# Altium schematic sheet Audio.SchDoc
size B; SheetNumber: 2; SheetTotal: 5
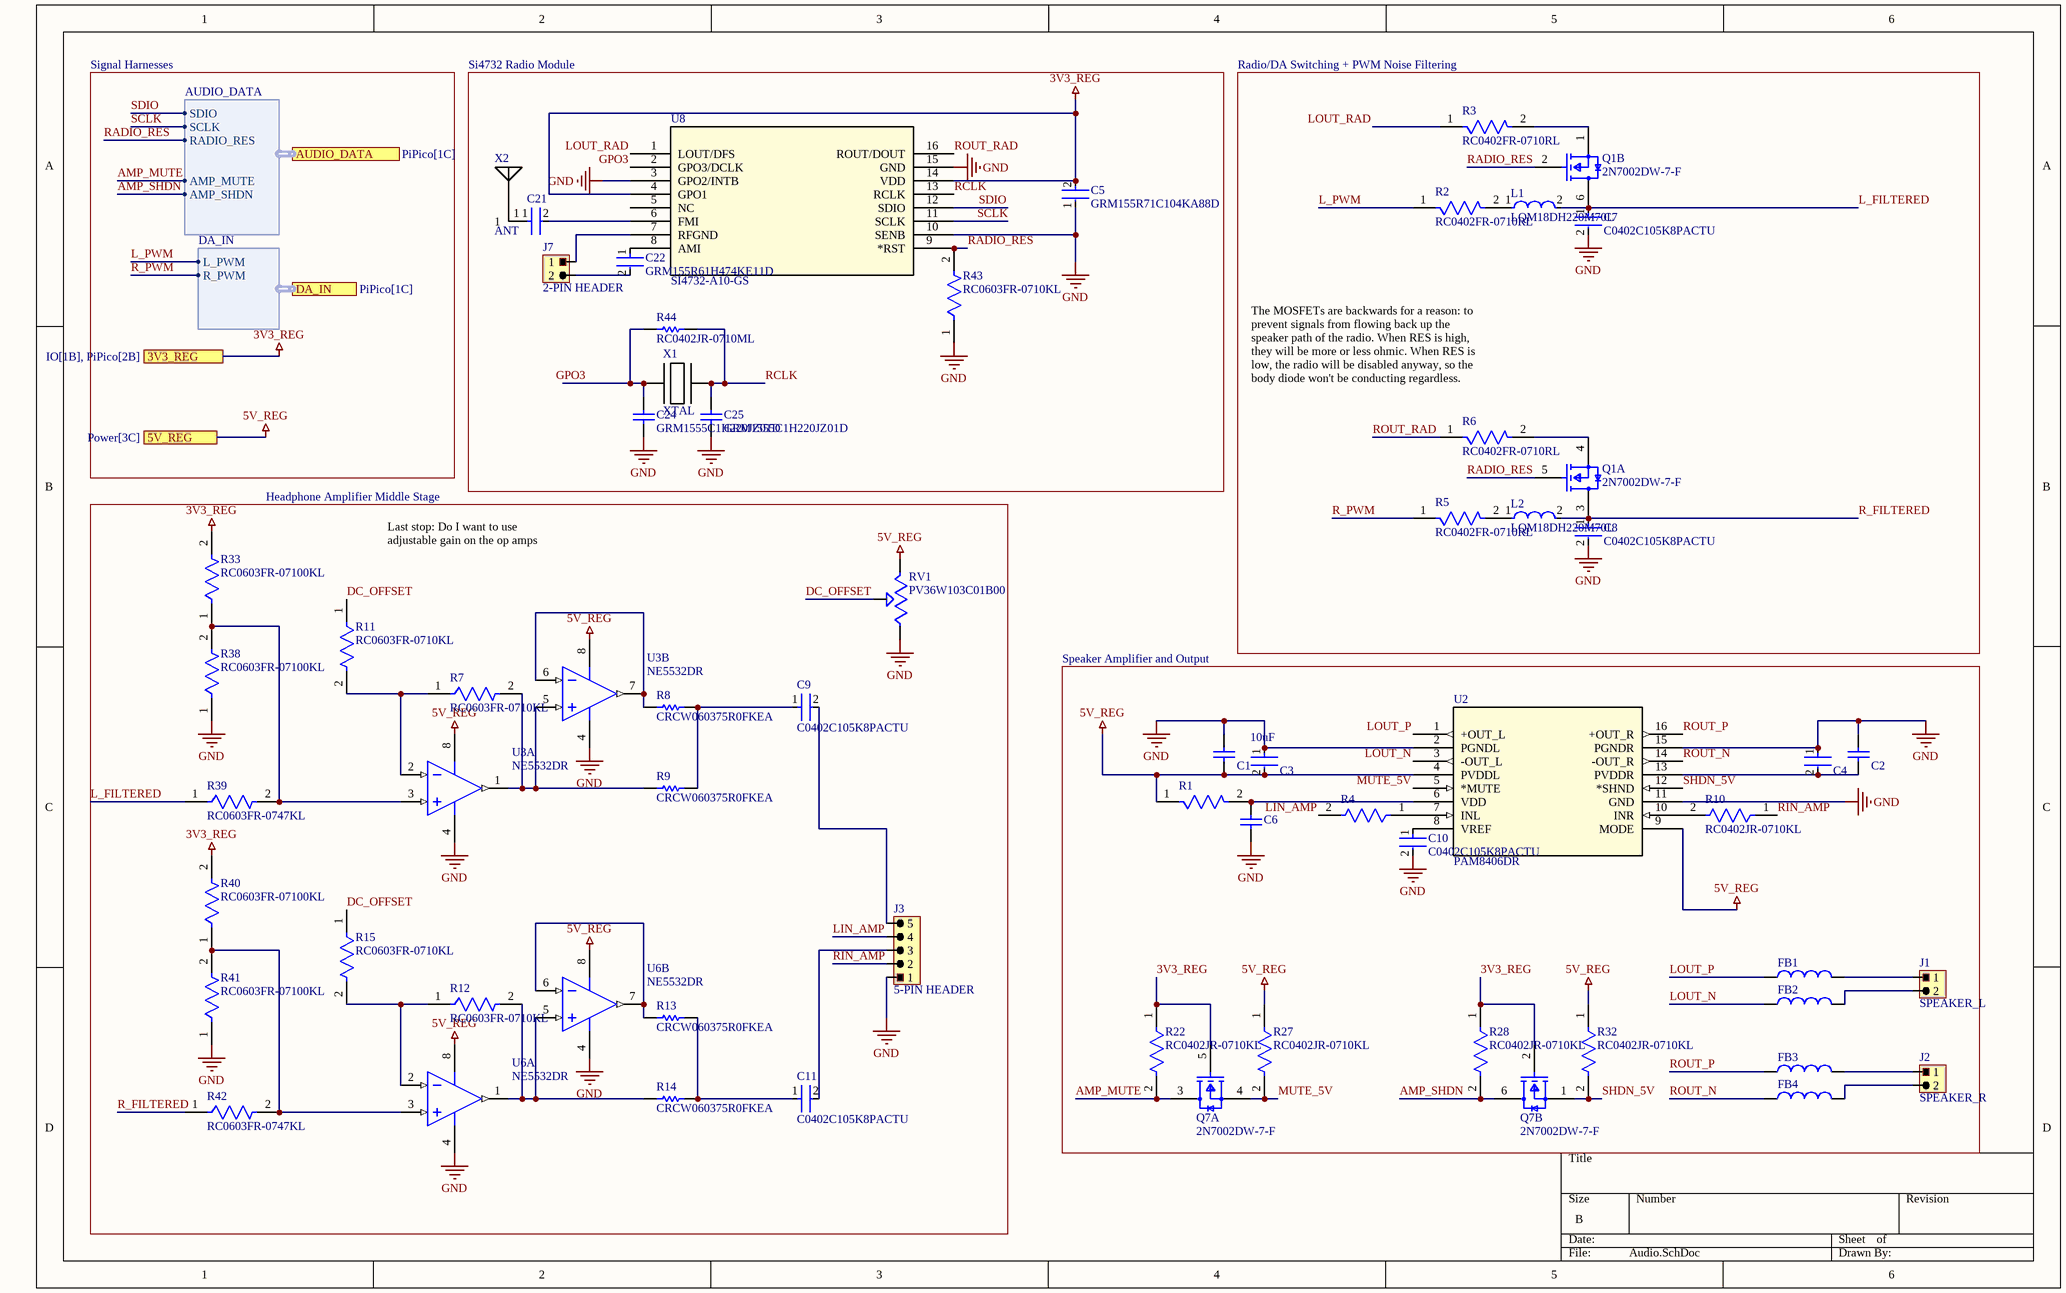
[diagram p0: Audio.SchDoc]

## Parts
C1  C0603C105K3RACTU  [CAPC1608X87X35LL15T15]  (value not drawn)
C2  C0603C105K3RACTU  [CAPC1608X87X35LL15T15]  (value not drawn)
C3  Capacitance: 10uF  [FP-C0805C-DG-MFG]  (hidden comment: C0805C106K8PACTU)
C4  C0805C106K8PACTU  [FP-C0805C-DG-MFG]  (value not drawn)
C5  GRM155R71C104KA88D  [FP-GRM15-MFG]
C6  C0603C105K3RACTU  [CAPC1608X87X35LL15T15]  (value not drawn)
C7  C0402C105K8PACTU  [FP-C0402C105K8PACTU-MFG]
C8  C0402C105K8PACTU  [FP-C0402C105K8PACTU-MFG]
C9  C0402C105K8PACTU  [FP-C0402C105K8PACTU-MFG]
C10  C0402C105K8PACTU  [FP-C0402C105K8PACTU-MFG]
C11  C0402C105K8PACTU  [FP-C0402C105K8PACTU-MFG]
C21  GRM1555C1H102JA01D  [FP-GRM155-0_05-IPC_B]  (value not drawn)
C22  GRM155R61H474KE11D  [FP-GRM155-0_1-IPC_B]
C24  GRM1555C1H220JZ01D  [CAPC1005X55X25NL05T10]
C25  GRM1555C1H220JZ01D  [CAPC1005X55X25NL05T10]
FB1  742792097  [WE-CBF_0805_L2W1.2H0.9_HC]  (value not drawn)
FB2  742792097  [WE-CBF_0805_L2W1.2H0.9_HC]  (value not drawn)
FB3  742792097  [WE-CBF_0805_L2W1.2H0.9_HC]  (value not drawn)
FB4  742792097  [WE-CBF_0805_L2W1.2H0.9_HC]  (value not drawn)
J1  SPEAKER_L  [2-pin Header (Generic)]
J2  SPEAKER_R  [2-pin Header (Generic)]
J3  5-PIN HEADER  [5-pin Header (Generic)]
J7  2-PIN HEADER  [2-pin Header (Generic)]
L1  LQM18DH220M70L  [FP-LQM18DN_70-MFG]
L2  LQM18DH220M70L  [FP-LQM18DN_70-MFG]
Q1  2N7002DW-7-F  [FP-SOT363-IPC_C]  (parts A,B of 2)
Q7  2N7002DW-7-F  [FP-SOT363-IPC_C]  (parts A,B of 2)
R1  RC0402FR-0710RL  [FP-RC0402-0_4-MFG]  (value not drawn)
R2  RC0402FR-0710RL  [FP-RC0402-0_4-MFG]
R3  RC0402FR-0710RL  [FP-RC0402-0_4-MFG]
R4  RC0402JR-0710KL  [RC0402N_YAG]  (value not drawn)
R5  RC0402FR-0710RL  [FP-RC0402-0_4-MFG]
R6  RC0402FR-0710RL  [FP-RC0402-0_4-MFG]
R7  RC0603FR-0710KL  [FP-RC0603-0_55-IPC_C]
R8  CRCW060375R0FKEA  [RESC1609X50X30LL10T20]
R9  CRCW060375R0FKEA  [RESC1609X50X30LL10T20]
R10  RC0402JR-0710KL  [RC0402N_YAG]
R11  RC0603FR-0710KL  [FP-RC0603-0_55-IPC_C]
R12  RC0603FR-0710KL  [FP-RC0603-0_55-IPC_C]
R13  CRCW060375R0FKEA  [RESC1609X50X30LL10T20]
R14  CRCW060375R0FKEA  [RESC1609X50X30LL10T20]
R15  RC0603FR-0710KL  [FP-RC0603-0_55-IPC_C]
R22  RC0402JR-0710KL  [RC0402N_YAG]
R27  RC0402JR-0710KL  [RC0402N_YAG]
R28  RC0402JR-0710KL  [RC0402N_YAG]
R32  RC0402JR-0710KL  [RC0402N_YAG]
R33  RC0603FR-07100KL  [FP-RC0603-0_55-MFG]
R38  RC0603FR-07100KL  [FP-RC0603-0_55-MFG]
R39  RC0603FR-0747KL  [FP-RC0603FR-0747KL-MFG]
R40  RC0603FR-07100KL  [FP-RC0603-0_55-MFG]
R41  RC0603FR-07100KL  [FP-RC0603-0_55-MFG]
R42  RC0603FR-0747KL  [FP-RC0603FR-0747KL-MFG]
R43  RC0603FR-0710KL  [FP-RC0603-0_55-IPC_C]
R44  RC0402JR-0710ML  [RESC1005X40X25ML05T10]
RV1  PV36W103C01B00  [TRIM_PV36W103C01B00]
U2  PAM8406DR  [SO-16_PAM8406_DIO]
U3  NE5532DR  [D0008A_N]  (parts A,B of 2)
U6  NE5532DR  [D0008A_N]  (parts A,B of 2)
U8  SI4732-A10-GS  [SOIC_A10-GS_SIL]
X1  XTAL  [FC-135 32.7680KA-AG0]
X2  ANT  [FM_ANTENNA_OUT]

## Blocks framed on the sheet
Si4732 Radio Module: C5 C21 C22 C24 C25 J7 R43 R44 U8 X1 X2
Radio/DA Switching + PWM Noise Filtering: C7 C8 L1 L2 Q1 R2 R3 R5 R6
Headphone Amplifier Middle Stage: C9 C11 J3 R7-R9 R11-R15 R33 R38-R42 RV1 U3 U6
Speaker Amplifier and Output: C1-C4 C6 C10 FB1-FB4 J1 J2 Q7 R1 R4 R10 R22 R27 R28 R32 U2

## Ports
3V3_REG (see IO[1B], PiPico[2B]), 5V_REG (see Power[3C]), AUDIO_DATA (harness AUDIO_DATA, see PiPico[1C]), DA_IN (harness DA_IN, see PiPico[1C])

## Harnesses
AUDIO_DATA: SDIO, SCLK, AMP_MUTE, AMP_SHDN, RADIO_RES
DA_IN: L_PWM, R_PWM

## Nets
3V3_REG: C5.2 Q7.2(G2) Q7.5(G1) R22.1 R28.1 R33.2 R40.2 U8.4(GPO1) U8.14(VDD) ; port 3V3_REG
5V_REG: C1.1 C3.2 R1.1 R27.1 R32.1 RV1.3 U2.4(PVDDL) U2.9(MODE) U3.8(VCC+) U6.8(VCC+) ; port 5V_REG
GND: C1.2 C2.2 C3.1 C4.1 C5.1 C6.1 C7.2 C8.2 C10.2 C24.1 C25.1 J3.1 R38.1 R41.1 R43.1 RV1.1 U2.2(PGNDL) U2.11(GND) U2.15(PGNDR) U3.4(VCC-) U6.4(VCC-) U8.3(GPO2/INTB) U8.10(SENB) U8.15(GND)
AMP_MUTE: Q7.3(D1) R22.2 ; port AUDIO_DATA.AMP_MUTE
AMP_SHDN: Q7.6(D2) R28.2 ; port AUDIO_DATA.AMP_SHDN
DC_OFFSET: R11.1 R15.1 RV1.2
GPO3: C24.2 R44.1 U8.2(GPO3/DCLK) X1.2
L_FILTERED: C7.1 L1.2 Q1.6(D2) R39.1
L_PWM: R2.1 ; port DA_IN.L_PWM
LIN_AMP: J3.4 R4.2
LOUT_N: FB2.1 U2.3(-OUT_L)
LOUT_P: FB1.1 U2.1(+OUT_L)
LOUT_RAD: R3.1 U8.1(LOUT/DFS)
MUTE_5V: Q7.4(S1) R27.2 U2.5(*MUTE)
R_FILTERED: C8.1 L2.2 Q1.3(D1) R42.1
R_PWM: R5.1 ; port DA_IN.R_PWM
RADIO_RES: Q1.2(G2) Q1.5(G1) R43.2 U8.9(*RST) ; port AUDIO_DATA.RADIO_RES
RCLK: C25.2 R44.2 U8.13(RCLK) X1.1
RIN_AMP: J3.2 R10.1
ROUT_N: FB4.1 U2.14(-OUT_R)
ROUT_P: FB3.1 U2.16(+OUT_R)
ROUT_RAD: R6.1 U8.16(ROUT/DOUT)
SCLK: U8.11(SCLK) ; port AUDIO_DATA.SCLK
SDIO: U8.12(SDIO) ; port AUDIO_DATA.SDIO
SHDN_5V: Q7.1(S2) R32.2 U2.12(*SHND)
NetC2_1: C2.1 C4.2 U2.13(PVDDR)
NetC6_2: C6.2 R1.2 U2.6(VDD)
NetC9_1: C9.1 R8.2 R9.2
NetC9_2: C9.2 J3.5
NetC10_1: C10.1 U2.8(VREF)
NetC11_1: C11.1 R13.2 R14.2
NetC11_2: C11.2 J3.3
NetC21_1: C21.1 X2.1
NetC21_2: C21.2 U8.6(FMI)
NetC22_1: C22.1 U8.8(AMI)
NetC22_2: C22.2 J7.2
NetFB1_2: FB1.2 J1.1
NetFB2_2: FB2.2 J1.2
NetFB3_2: FB3.2 J2.1
NetFB4_2: FB4.2 J2.2
NetJ7_1: J7.1 U8.7(RFGND)
NetL1_1: L1.1 R2.2
NetL2_1: L2.1 R5.2
NetQ1_1: Q1.1(S2) R3.2
NetQ1_4: Q1.4(S1) R6.2
NetR4_1: R4.1 U2.7(INL)
NetR7_1: R7.1 R11.2 U3.2(IN1-)
NetR7_2: R7.2 R9.1 U3.1(OUT1) U3.5(IN2+)
NetR8_1: R8.1 U3.6(IN2-) U3.7(OUT2)
NetR10_2: R10.2 U2.10(INR)
NetR12_1: R12.1 R15.2 U6.2(IN1-)
NetR12_2: R12.2 R14.1 U6.1(OUT1) U6.5(IN2+)
NetR13_1: R13.1 U6.6(IN2-) U6.7(OUT2)
NetR33_1: R33.1 R38.2 R39.2 U3.3(IN1+)
NetR40_1: R40.1 R41.2 R42.2 U6.3(IN1+)

Not connected (* = marked no-connect by the designer): U8 5(NC)

## Notes on the sheet
- Signal Harnesses
- (near R6) The MOSFETs are backwards for a reason: to prevent signals from flowing back up the speaker path of the radio. When RES is high, they will be more or less ohmic. When RES is low, the radio will be disabled anyway, so the body diode won't be conducting regardless.
- Last stop: Do I want to use adjustable gain on the op amps

## Library data of the parts
C1 C2 C6 = CMP-2006-03713-1: Manufacturer: Kemet; Part Number: C0603C105K3RACTU
C3 C4 = CMP-2007-03243-2: CAP CER 10UF 10V X5R 0805; Manufacturer: Kemet; 3DS Part Number: 220-00001; Tolerance: 10%; Temperature Coefficient: 15%; Material: Ceramic; Device Class L2: Capacitors; Device Class L1: Passive Components; ComponentLink2URL: https://content.kemet.com/datasheets/KEM_C1006_X5R_SMD.pdf; Height: 1.4mm; Lead Free: Yes; Manufacturer Part Number: C0805C106K8PACTU; Digikey Description: CAP CER 10UF 10V X5R 0805; Octopart: https://octopart.com/c0805c106k8pactu-kemet-98697; Value: 10uF; Temperature Range Low: -55°C; Temperature: -55°C to +85°C; Automotive: No; Mouser Description: CAP CER 10UF 10V X5R 0805; Ipc Land Pattern Name: CAPC200125X125; Temperature Range High: +85°C; Voltage: 10V; RoHS: TRUE; Device Class L3: Ceramic Capacitors; ComponentLink2Description: Datasheet; Voltage Rating: 10V; Package: C0805C-DG; Temperature Characteristic: X5R; Category: Cap
  C4: Capacitance: 10uF
C5 = CMP-2100-03641-2: CAP CER 0.1UF 16V X7R 0402; Manufacturer: Murata; Standoff Height: 0mm; Tolerance: 10%; Description: CAP Ceramic 0.10μF 10% X7R 16Vdc 0402 SMD; Voltage Rating: 16Vdc; Material: Ceramic; Capacitance: 0.10μF; Value: 0.10μF; RoHS: TRUE; Manufacturer Part Number: GRM155R71C104KA88D; Temperature Characteristic: X7R; Octopart: https://octopart.com/grm155r71c104ka88d-murata-196880; Digikey Description: CAP CER 0.1UF 16V X7R 0402; Device Class L3: Ceramic Capacitors; Height: 0.55mm; ComponentLink2Description: Datasheet; Temperature Range Low: -55°C; Ipc Land Pattern Name: CAPC10050X219; ComponentLink2URL: https://search.murata.co.jp/Ceramy/image/img/A01X/G101/ENG/GRM155R71H471KA01-01A.pdf; Device Class L1: Passive Components; Lead Free: yes; Category: Cap; Package: GRM15; Temperature: -55°C to +125°C; Device Class L2: Capacitors; Temperature Range High: +125°C; Mouser Description: 0402 0.1 uF 16V ±10 % Tolerance X7R SMT Multilayer Ceramic Capacitor
C7-C11 = CMP-2008-02081-2: CAP CER 1UF 10V X5R 0402; Dielectric Material: Ceramic; Dissipation Factor: 5%; Tolerance: 10%; Number of Pins: 2; Contact Plating: Tin; Min Operating Temperature: -55°C; Termination: SMD/SMT; Lead Free: Lead Free; Construction: Flat; Voltage Rating (DC): 10V; Mount: Surface Mount; Series: C; Thickness: 0.022inch; Width: 0.5mm; Radiation Hardening: No; Capacitance: 1uF; Dielectric: X5R; Height: 0.5mm; Voltage: 10V; Length: 1mm; Depth: 0.5mm; Max Operating Temperature: 85°C; Package Quantity: 1; Packaging: Tape and Reel; RoHS Compliant: Yes; Case Code (Imperial): 0402; Case Code (Metric): 1005; REACH SVHC: No SVHC; Voltage Rating: 10V; Case/Package: 0402
C21 = CMP-2008-04254-2: Chip Multilayer Ceramic Capacitors for General Purpose, 0402, 1000pF, C0G, 30ppm/°C, 5%, 50V; Insulation Resistance: 10GR; Capacitance: 1nF; Packaging: Tape and Reel; Lead Free: Lead Free; Tolerance: 5%; Temperature Coefficient: 30ppm/°C; Thickness: 0.022inch; Termination: SMD/SMT; Max Operating Temperature: 125°C; Height: 0.5mm; Package Quantity: 1; Radiation Hardening: No; Material: Ceramic; Case Code (Metric): 1005; Number of Pins: 2; Voltage Rating: 50V; Mount: Surface Mount; Voltage: 50V; Case/Package: 0402; Min Operating Temperature: -55°C; Dielectric Material: Ceramic; Width: 0.5mm; Depth: 0.5mm; Case Code (Imperial): 0402; REACH SVHC: No SVHC; Dielectric: C0G; Voltage Rating (DC): 50V; Length: 1mm
C22 = CMP-06035-008741-1: Chip Multilayer Ceramic Capacitors for General Purpose, 0402, 0.47uF, X5R, 15%, 10%, 50V; Capacitance: 470nF; Dielectric: X5R; Voltage Rating (DC): 50V; Width: 500um; Tolerance: 10%; Length: 1mm; Thickness: 500um
C24 C25 = CMP-2008-04304-1: Manufacturer: Murata; Part Number: GRM1555C1H220JZ01D
FB1-FB4 = CMP-0220-00149-3: NexarPartId: 22803129; Max Current Rating: 1A; Inductance: 1.8nH; Resistance: 300mΩ; Number of Lines: 1; Test Frequency: 100MHz; Tolerance: 25%; Impedance: 1.5kΩ; Min Operating Temperature: -55°C; Core Material: Ferrite; Depth: 1.2mm; Lead Free: Lead Free; Length: 2mm; Packaging: Digi-Reel®; Case Code (Imperial): 0805; Current Rating: 1A; Max Operating Temperature: 125°C; Case Code (Metric): 2012; RoHS: Compliant; RMS Current (Irms): 1A; Mount: Surface Mount; Material: Ferrite; DC Resistance (DCR): 300mΩ; Height: 900µm; Series Resistance: 300mΩ; Termination: SMD/SMT; Max DC Current: 1A; Weight: 10.999615mg; REACH SVHC: Unknown; Width: 1.2mm; Case/Package: 0805
J1 J2 = 2-PIN HEADER
L1 L2 = CMP-00260-119446615-1: LQM18DH220M70L Inductor Chip Shielded Multilayer 22uH 20% 1MHz Ferrite 200mA 0603 Emboss T/R; Series Resistance: 3.12Ω; Self Resonant Frequency: 15MHz; Inductance: 22µH; Saturation Current: 50mA; NexarPartId: 119446615; Test Frequency: 1MHz; Resistance: 3.12Ω; Tolerance: 20%; Min Operating Temperature: -55°C; Max Operating Temperature: 150°C; RMS Current (Irms): 200mA; Lifecycle Status: Production; Height: 950µm; Case/Package: 0603; Core Material: Ferrite
Q1 Q7 = CMP-2000-05563-2: MOSFET 2N-CH 60V 0.23A SOT-363; Input Capacitance: 50pF; Rds On Max: 7.5R; Continuous Drain Current (ID): 115mA; Element Configuration: Dual; Threshold Voltage: 2V; Number of Channels: 2; Turn-Off Delay Time: 11ns; Max Power Dissipation: 200mW; Power Dissipation: 400mW; Drain to Source Breakdown Voltage: 70V; FET Type: 2 N-Channel; Turn-On Delay Time: 7ns; Drain to Source Resistance: 4.4R; Gate to Source Voltage (Vgs): 20V; Height: 1mm; REACH SVHC: No SVHC; Package Quantity: 3000; Width: 1.35mm; On-State Resistance: 7.5R; Case/Package: SOT-363; Lead Free: Lead Free; Voltage Rating (DC): 60V; Contact Plating: Tin; Drain to Source Voltage (Vdss): 60V; Packaging: Tape and Reel; Number of Pins: 6; Current Rating: 115mA; Nominal Vgs: 2V; Length: 2.2mm; Termination: SMD/SMT; Max Operating Temperature: 150°C; Dual Supply Voltage: 60V; Weight: 0.000212oz; Radiation Hardening: No; Min Operating Temperature: -55°C; Number of Elements: 2; Mount: Surface Mount
R1-R3 R5 R6 = CMP-2002-07358-2: NexarPartId: 55458463; Tolerance: 1%; Working Voltage: 50V; Power Rating: 63mW; Temperature Coefficient: 100ppm/°C; Resistance: 10Ω; Packaging: Tape & Reel; RoHS: Compliant; Case/Package: 0402; Voltage Rating (AC): 50V; Width: 500µm; Voltage Rating (DC): 50V; Termination: SMD/SMT; REACH SVHC: Unknown; Military Standard: Not; Number of Pins: 2; Lead Free: Lead Free; Schedule B: 8533210045, 8533210045; Max Operating Temperature: 155°C; Voltage Rating: 50V; Case Code (Metric): 0402; Length: 1mm; Min Operating Temperature: -55°C; Case Code (Imperial): 0402; Height: 320µm; Composition: Thick Film; Depth: 500µm; Number of Terminations: 2
R4 R10 R22 R27 R28 R32 = CMP-2002-07915-3: RES 10K OHM 5% 1/16W 0402; Max Power Dissipation: 63mW; Temperature Coefficient: 100ppm/°C; Power Rating: 62.5mW; Resistance: 10kR; Voltage Rating: 50V; Size Code: 0402; Resistance Tolerance: 5%; Packaging: Tape and Reel; Case Code (Metric): 1005; Lead Free: Lead Free; Resistor Type: Thick Film; Min Operating Temperature: -55°C; Military Standard: Not; Depth: 0.5mm; Series: RC; Case/Package: 0402; Construction: Rectangular; Number of Terminations: 2; Package Quantity: 1; Termination: SMD/SMT; Length: 0.039inch; Case Code (Imperial): 0402; Height: 0.016inch; Features: Moisture Resistant; RoHS Compliant: Yes; Max Operating Temperature: 155°C; Tolerance: 5%; Width: 0.02inch
R7 R11 R12 R15 R43 = CMP-2100-03664-2: RES 10K OHM 1% 1/10W 0603; Voltage Rating: 75V; Voltage Rating (DC): 50V; Resistance: 10kR; Power Rating: 100mW; Temperature Coefficient: 100ppm/°C; Depth: 0.8mm; Termination: SMD/SMT; Resistor Type: Thick Film; Series: RC; Construction: Rectangular; Features: Moisture Resistant; Packaging: Tape and Reel; Min Operating Temperature: -55°C; Number of Terminations: 2; Lead Pitch: 0.3mm; RoHS Compliant: Yes; Case/Package: 0603; Resistance Tolerance: 1%; Military Standard: Not; Weight: 7.1E-05oz; Number of Pins: 2; Tolerance: 1%; Length: 1.6mm; Case Code (Imperial): 0603; Lead Free: Lead Free; Width: 0.8mm; Max Power Dissipation: 100mW; Height: 0.45mm; Max Operating Temperature: 155°C; Case Code (Metric): 1608; Size Code: 0603
R8 R9 R13 R14 = CMP-2000-03573-1: Manufacturer: Vishay Dale; Part Number: CRCW060375R0FKEA
R33 R38 R40 R41 = CMP-2100-03662-2: RES SMD 100K OHM 1% 1/10W 0603; Voltage Rating (DC): 50V; Resistance: 100kR; Max Power Dissipation: 100mW; Temperature Coefficient: 100ppm/°C; Working Voltage: 75V; Length: 1.6mm; Lead Free: Lead Free; Number of Terminations: 2; Packaging: Tape and Reel; Voltage Rating: 50V; Termination: SMD/SMT; Width: 0.8mm; Resistor Type: Thick Film; Resistance Tolerance: 1%; Features: Moisture Resistant; Height: 0.45mm; Construction: Rectangular; Case/Package: 0603; Military Standard: Not; Case Code (Imperial): 0603; Series: RC; Technology: THICK FILM; Depth: 0.8mm; RoHS Compliant: Yes; REACH SVHC: No SVHC; Min Operating Temperature: -55°C; Case Code (Metric): 1608; Max Operating Temperature: 155°C; Power Rating: 100mW; Number of Pins: 2; Tolerance: 1%
R39 R42 = CMP-1659-00055-2: RES SMD 47K OHM 1% 1/10W 0603; Voltage Rating: 50V; Temperature Coefficient: 100ppm/°C; Max Power Dissipation: 100mW; Resistance: 47kR; Voltage Rating (DC): 50V; Min Operating Temperature: -55°C; Packaging: Tape and Reel; Features: Moisture Resistant; Termination: SMD/SMT; Technology: THICK FILM; Lead Free: Lead Free; Max Operating Temperature: 155°C; Width: 0.031inch; Case Code (Metric): 1608; Tolerance: 1%; Package Quantity: 1; Resistor Type: Thick Film; RoHS Compliant: Yes; Case/Package: 0603; Case Code (Imperial): 0603; Resistance Tolerance: 1%; Length: 0.063inch; Series: RC; Number of Pins: 2; Power Rating: 100mW; Number of Terminations: 2; Construction: Rectangular; Height: 0.022inch; Military Standard: Not; Size Code: 0603; Depth: 0.8mm
R44 = CMP-2002-07916-1: Manufacturer: Yageo / Phycomp; Part Number: RC0402JR-0710ML
RV1 = PV36W103C01B00: 10 kOhms 0.5W, 1/2W PC Pins Through Hole Trimmer Potentiometer Cermet 25.0 Turn Top Adjustment; MF: Bourns; DigiKey_Part_Number: 118-PV36W103C01B00-ND; Purchase-URL: https://pricing.snapeda.com/search?q=PV36W103C01B00&ref=eda; Package: PV36W Bourns; Check_prices: https://www.snapeda.com/parts/PV36W103C01B00/Bourns/view-part/?ref=eda; Value: *; SnapEDA_Link: https://www.snapeda.com/parts/PV36W103C01B00/Bourns/view-part/?ref=snap; MP: PV36W103C01B00
U2 = PAM8406DR: No Description Available; Mfr_Name: Diodes Inc; RefDes: RefDes; Type: Type
U3 U6 = CMP-0015-00074-2: Dual Low-Noise High-Speed Audio Operational Amplifier, 10 to 30 V, 0 to 70 degC, 8-pin SOIC (D8), Green (RoHS & no Sb/Br); Manufacturer: Texas Instruments; Vn at 1kHz(Typ)(nV/rtHz): 5; Total Supply Voltage(Max)(+5V is 5, +/-5V is 10): 30; Number of Channels: 2; CMRR(Min)(dB): 70; GBW(Typ)(MHz): 10; IIB(Max)(pA): 800000; Sub Family: General Purpose Amplifier, High Supply Voltage Amplifier (>=30V), Low Noise Amp (<=10nV/rtHz); Iq per channel(Max)(mA): 4; Slew Rate(Typ)(V/us): 9; ComponentLink3Description: Package Specification; Mounting Technology: Surface Mount; PackageVersion: 4040047-3/M, 06/2011; PackageReference: D0008A; ComponentLink2Description: Datasheet; PackageDescription: 8-Pin Plastic Small Outline, Body 4.9 x 3.9 mm, Pitch 1.27 mm; PartNumber: NE5532DR; ComponentLink1URL: http://www.ti.com/; ComponentLink3URL: http://www.ti.com/litv/pdf/msoi002j; Code_JEDEC: MS-012; Eco-Plan: Green (RoHS & no Sb/Br); ComponentLink1Description: Manufacturer URL; Total Supply Voltage(Min)(+5V is 5, +/-5V is 10): 10; ComponentLink2URL: http://www.ti.com/lit/ds/symlink/ne5532.pdf; Vio (25C)(Max)(mV): 4; DatasheetVersion: SLOS075I
U8 = SI4732-A10-GS: No Description Available; Mfr_Name: Silicon Labs; RefDes: RefDes; Type: Type
X1 = FC-135 32.7680KA-AG0
X2 = FM_OUT